# EAGLE design grandprix (EAGLE 9.6.0)
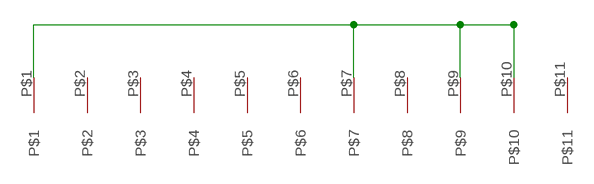
[diagram p0: schematic, sheet 1]

## Parts
U$1  ADVCHIP  [ADCHIP]

## Nets
N$10: U$1.P$1 U$1.P$7 U$1.P$9 U$1.P$10
Unconnected: U$1.P$2 U$1.P$3 U$1.P$4 U$1.P$5 U$1.P$6 U$1.P$8 U$1.P$11

## Library data of the parts
U$1 = advpins:ADVCHIP

## Board
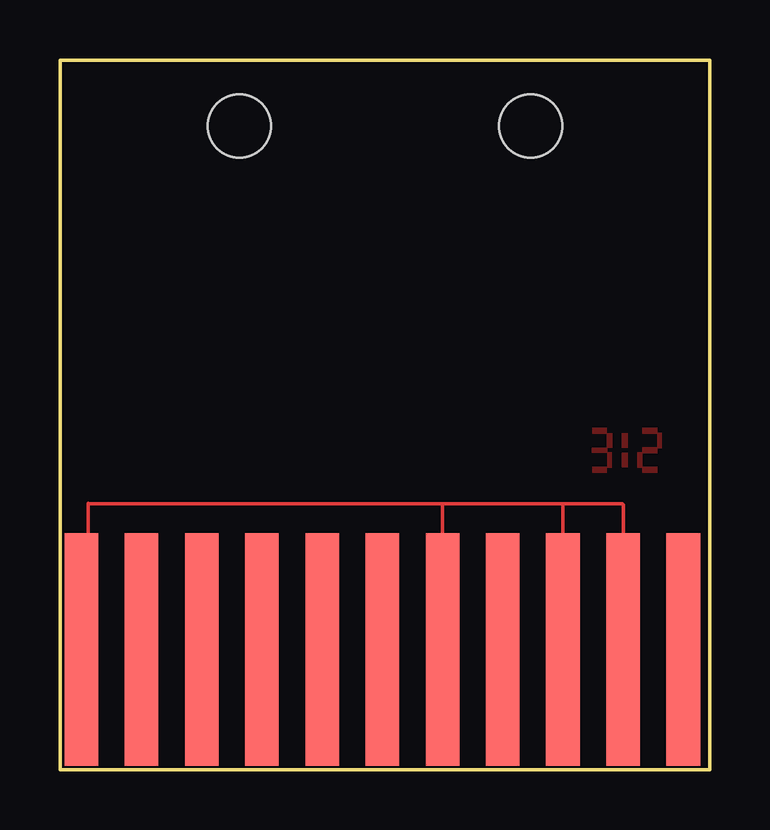
[diagram p1: board, top side]

Size 27.1 x 29.58 mm. Coordinates in mm from the lower left corner, seen from the top.
Outline: 0,29.58 0,0 27.1,0 27.1,29.58 0,29.58
Copper layers (1*16): Top 0.035mm / dielectric 1.5mm / Bottom 0.035mm
Design rules "default": minimum track width 6mil, minimum drill 0.35mm, track to track 6mil, track to pad 6mil, pad to pad 6mil, via to via 6mil, smd to smd 6mil, copper to edge 40mil, drill to drill 6mil, minimum pad ring 10mil, minimum via ring 8mil, stop-mask expansion 4mil, vias tented up to drill 0mil, thermal gap 10mil
Holes 2.62 mm at 7.48,26.83 19.62,26.83

### Footprints (pad centres in the part's own frame; a part is rotated, then mirrored left to right if it is on the bottom)
ADCHIP = smd 1.4 x 9.7: P$1 -27.61,5.02; P$2 -25.1,5.02; P$3 -22.59,5.02; P$4 -20.08,5.02; P$5 -17.57,5.02; P$6 -15.06,5.02; P$7 -12.55,5.02; P$8 -10.04,5.02; P$9 -7.53,5.02; P$10 -5.02,5.02; P$11 -2.51,5.02

### Placement (x,y rotation side)
U$1  28.5,0 0 top

### Tracks (layer width: path | path; a pad name or v marks a point on that pad's centre or on a via)
N$1
  pour Top: 23.02,13.42 22.82,13.42 22.82,14.03 23.02,14.03
N$2
  pour Top: 22.81,13.22 22.2,13.22 22.2,13.42 22.81,13.42
N$3
  pour Top: 22.82,13.22 22.82,12.6 23.02,12.6 23.02,13.22
N$4
  pour Top: 22.2,12.6 22.2,12.4 22.81,12.4 22.81,12.6
N$5
  pour Top: 24.9,14.03 24.9,13.42 25.1,13.42 25.1,14.03
N$6
  pour Top: 24.29,13.42 24.29,13.22 24.9,13.22 24.9,13.42
N$7
  pour Top: 24.08,13.22 24.08,12.61 24.28,12.61 24.28,13.22
N$8
  pour Top: 24.29,12.61 24.29,12.4 24.9,12.4 24.9,12.61
N$10
  Top 0.152: 23.43,5.03 U$1.P$10 23.48,11.06 23.45,11.09 20.97,11.09 | 20.97,11.09 15.94,11.09 | U$1.P$7 15.95,11.08 15.94,11.09 | 1.26,9.01 1.17,9.11 1.17,9.87 | 1.17,9.87 1.17,11.1 1.18,11.09 15.94,11.09 | U$1.P$1 0.89,9.59 1.17,9.87 | U$1.P$9 20.97,11.09
N$13
  pour Top: 22.2,14.24 22.2,14.03 22.81,14.03 22.81,14.24
N$14
  pour Top: 23.66,13.42 23.45,13.42 23.45,14.03 23.66,14.03
N$15
  pour Top: 23.66,12.6 23.45,12.6 23.45,13.22 23.66,13.22
N$17
  pour Top: 24.29,14.24 24.29,14.03 24.9,14.03 24.9,14.24